# Altium project BugBuster_HAT.PrjPcb
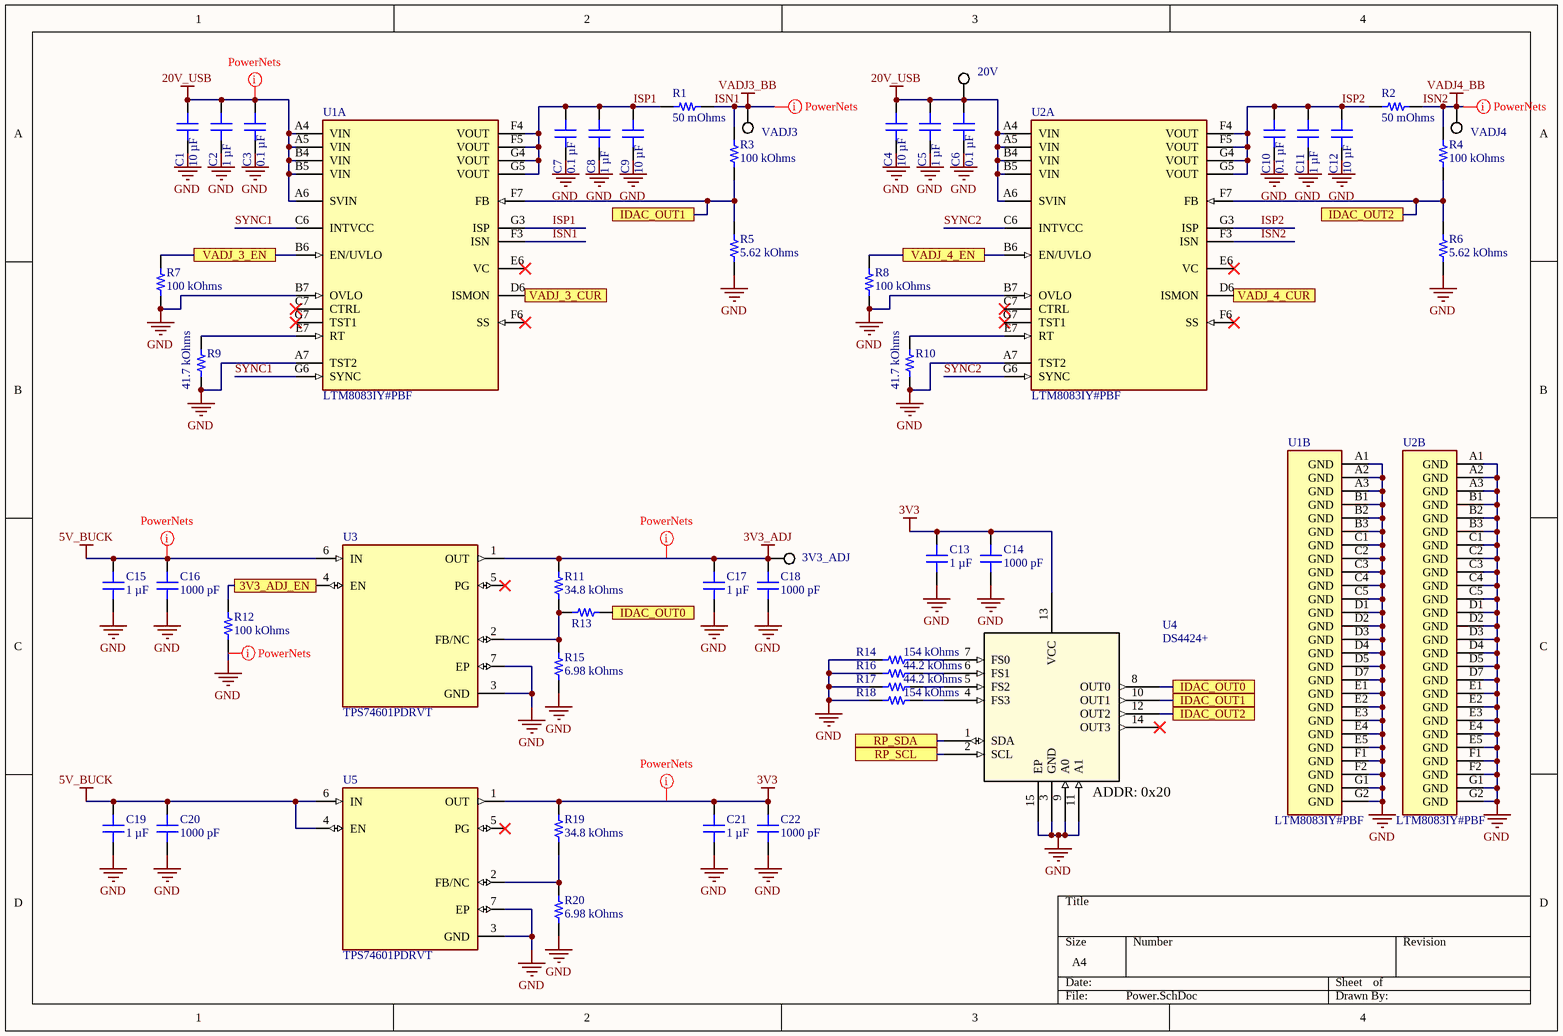
[diagram p0: Power.SchDoc]
3 sheets, 115 parts. Net scope: flat (ports and power ports of the same name join across sheets).
Board file: BugBuster_HAT.PcbDoc
Sheets:
  Power.SchDoc
  RP2040.SchDoc
  IOs.SchDoc

## Sheet Power.SchDoc
size A4; SheetNumber: 1; SheetTotal: 3

### Parts
3V3_ADJ  TP_SMD_1  [TP_1.0mm]  (value not drawn)  (no BOM)
20V  TP_SMD_1  [TP_1.0mm]  (value not drawn)  (no BOM)
C1  10 µF  [CAP 1210_3225 - 1MM]
C2  1 µF  [CAP 0603_1608]
C3  0.1 µF  [CAP 0603_1608]
C4  10 µF  [CAP 1210_3225 - 1MM]
C5  1 µF  [CAP 0603_1608]
C6  0.1 µF  [CAP 0603_1608]
C7  0.1 µF  [CAP 0603_1608]
C8  1 µF  [CAP 0603_1608]
C9  10 µF  [CAP 1210_3225 - 1MM]
C10  0.1 µF  [CAP 0603_1608]
C11  1 µF  [CAP 0603_1608]
C12  10 µF  [CAP 1210_3225 - 1MM]
C13  1 µF  [CAP 0603_1608]
C14  1000 pF  [CAP 0603_1608]
C15  1 µF  [CAP 0603_1608]
C16  1000 pF  [CAP 0603_1608]
C17  1 µF  [CAP 0603_1608]
C18  1000 pF  [CAP 0603_1608]
C19  1 µF  [CAP 0603_1608]
C20  1000 pF  [CAP 0603_1608]
C21  1 µF  [CAP 0603_1608]
C22  1000 pF  [CAP 0603_1608]
R1  50 mOhms  [STACKPOLE CSR1206]
R2  50 mOhms  [STACKPOLE CSR1206]
R3  100 kOhms  [RES 0603_1608]
R4  100 kOhms  [RES 0603_1608]
R5  5.62 kOhms  [RES 0603_1608]
R6  5.62 kOhms  [RES 0603_1608]
R7  100 kOhms  [RES 0603_1608]
R8  100 kOhms  [RES 0603_1608]
R9  41.7 kOhms  [RES 0603_1608]
R10  41.7 kOhms  [RES 0603_1608]
R11  34.8 kOhms  [RES 0603_1608]
R12  100 kOhms  [RES 0603_1608]
R13  (no value)  [RES 0603_1608]
R14  154 kOhms  [RES 0603_1608]
R15  6.98 kOhms  [RES 0603_1608]
R16  44.2 kOhms  [RES 0603_1608]
R17  44.2 kOhms  [RES 0603_1608]
R18  154 kOhms  [RES 0603_1608]
R19  34.8 kOhms  [RES 0603_1608]
R20  6.98 kOhms  [RES 0603_1608]
U1  LTM8083IY#PBF  [FP-BGA-49-05-08-1518-MFG]  (parts A,B of 2)
U2  LTM8083IY#PBF  [FP-BGA-49-05-08-1518-MFG]  (parts A,B of 2)
U3  TPS74601PDRVT  [SON65P200X200X80-7N]
U4  DS4424+  [21-0137_T1433+2_MXM]
U5  TPS74601PDRVT  [SON65P200X200X80-7N]
VADJ3  TP_SMD_1  [TP_1.0mm]  (value not drawn)  (no BOM)
VADJ4  TP_SMD_1  [TP_1.0mm]  (value not drawn)  (no BOM)

### Ports
3V3_ADJ_EN, IDAC_OUT0, IDAC_OUT1, IDAC_OUT2, RP_SCL, RP_SDA, VADJ_3_CUR, VADJ_3_EN, VADJ_4_CUR, VADJ_4_EN

### Nets
3V3: C13.2 C14.2 C21.2 C22.2 R19.2 U4.13(VCC) U5.1(OUT)
3V3_ADJ: 3V3_ADJ.1 C17.2 C18.2 R11.2 U3.1(OUT)
5V_BUCK: C15.2 C16.2 C19.2 C20.2 U3.6(IN) U5.4(EN) U5.6(IN)
20V_USB: 20V.1 C1.2 C2.2 C3.2 C4.2 C5.2 C6.2 U1.A4(VIN) U1.A5(VIN) U1.A6(SVIN) U1.B4(VIN) U1.B5(VIN) U2.A4(VIN) U2.A5(VIN) U2.A6(SVIN) U2.B4(VIN) U2.B5(VIN)
GND: C1.1 C2.1 C3.1 C4.1 C5.1 C6.1 C7.1 C8.1 C9.1 C10.1 C11.1 C12.1 C13.1 C14.1 C15.1 C16.1 C17.1 C18.1 C19.1 C20.1 C21.1 C22.1 R5.1 R6.1 R7.1 R8.1 R9.1 R10.1 R12.1 R14.1 R15.1 R16.2 R17.2 R18.1 R20.1 U1.A1(GND) U1.A2(GND) U1.A3(GND) U1.A7(TST2) U1.B1(GND) U1.B2(GND) U1.B3(GND) U1.B7(OVLO) U1.C1(GND) U1.C2(GND) U1.C3(GND) U1.C4(GND) U1.C5(GND) U1.D1(GND) U1.D2(GND) U1.D3(GND) U1.D4(GND) U1.D5(GND) U1.D7(GND) U1.E1(GND) U1.E2(GND) U1.E3(GND) U1.E4(GND) U1.E5(GND) U1.F1(GND) U1.F2(GND) U1.G1(GND) U1.G2(GND) U2.A1(GND) U2.A2(GND) U2.A3(GND) U2.A7(TST2) U2.B1(GND) U2.B2(GND) U2.B3(GND) U2.B7(OVLO) U2.C1(GND) U2.C2(GND) U2.C3(GND) U2.C4(GND) U2.C5(GND) U2.D1(GND) U2.D2(GND) U2.D3(GND) U2.D4(GND) U2.D5(GND) U2.D7(GND) U2.E1(GND) U2.E2(GND) U2.E3(GND) U2.E4(GND) U2.E5(GND) U2.F1(GND) U2.F2(GND) U2.G1(GND) U2.G2(GND) U3.3(GND) U3.7(EP) U4.3(GND) U4.9(A0) U4.11(A1) U4.15(EP) U5.3(GND) U5.7(EP)
ISN1: R1.2 R3.2 U1.F3(ISN) VADJ3.1  [also labelled VADJ3_BB]
ISN2: R2.2 R4.2 U2.F3(ISN) VADJ4.1  [also labelled VADJ4_BB]
ISP1: C7.2 C8.2 C9.2 R1.1 U1.F4(VOUT) U1.F5(VOUT) U1.G3(ISP) U1.G4(VOUT) U1.G5(VOUT)
ISP2: C10.2 C11.2 C12.2 R2.1 U2.F4(VOUT) U2.F5(VOUT) U2.G3(ISP) U2.G4(VOUT) U2.G5(VOUT)
SCL: U4.2(SCL) ; port RP_SCL
SDA: U4.1(SDA) ; port RP_SDA
SYNC1: U1.C6(INTVCC) U1.G6(SYNC)
SYNC2: U2.C6(INTVCC) U2.G6(SYNC)
NetR3_1: R3.1 R5.2 U1.F7(FB) U4.10(OUT1) ; port IDAC_OUT1
NetR4_1: R4.1 R6.2 U2.F7(FB) U4.12(OUT2) ; port IDAC_OUT2
NetR7_2: R7.2 U1.B6(EN/UVLO) ; port VADJ_3_EN
NetR8_2: R8.2 U2.B6(EN/UVLO) ; port VADJ_4_EN
NetR9_2: R9.2 U1.E7(RT)
NetR10_2: R10.2 U2.E7(RT)
NetR11_1: R11.1 R13.1 R15.2 U3.2(FB/NC)
NetR12_2: R12.2 U3.4(EN) ; port 3V3_ADJ_EN
NetR13_2: R13.2 U4.8(OUT0) ; port IDAC_OUT0
NetR14_2: R14.2 U4.7(FS0)
NetR16_1: R16.1 U4.6(FS1)
NetR17_1: R17.1 U4.5(FS2)
NetR18_2: R18.2 U4.4(FS3)
NetR19_1: R19.1 R20.2 U5.2(FB/NC)
NetU1_D6: U1.D6(ISMON) ; port VADJ_3_CUR
NetU2_D6: U2.D6(ISMON) ; port VADJ_4_CUR

Not connected (* = marked no-connect by the designer): U1 C7(CTRL)* E6(VC)* F6(SS)* G7(TST1)*; U2 C7(CTRL)* E6(VC)* F6(SS)* G7(TST1)*; U3 5(PG)*; U4 14(OUT3)*; U5 5(PG)*

### Layout directives
net class PowerNets: 3V3, 3V3_ADJ, 5V_BUCK, 20V_USB, GND, ISN1, ISN2

### Notes on the sheet
- (near U4) ADDR: 0x20

### Library data of the parts
C1 C4 C9 C12 = GMC32X5R106M50NT: CAP1210 X5R 10UF 20% 50V; manufacturer: Cal-Chip Electronics, Inc.; Part Number: GMC32X5R106M50NT; Value: 10 µF; Applications: General Purpose; Capacitance: 10 µF; componentlink1description: Datasheet; componentlink1url: https://calchip.com/wp-content/uploads/2023/05/gmc_series.pdf; componentlink2description: DigiKey Link; componentlink2url: https://www.digikey.com/en/products/detail/cal-chip-electronics-inc/GMC32X5R106M50NT/21802006; Device Package: 1210 (3225 Metric); lastupdated: 04/06/2024 19:20:41; Lifecycle Status: Active; Minimum Order: 1; Mounting Type: Surface Mount, MLCC; Operating Temperature: -55°C ~ 85°C; Package / Case: 1210 (3225 Metric); packaging: TapeAndReel; partid: 58255; price: 0.13; series: GMC; Size / Dimension: 0.126" L x 0.098" W (3.20mm x 2.50mm); Supplier 1: DigiKey; Supplier Part Number 1: 4713-GMC32X5R106M50NTCT-ND; Temperature Coefficient: X5R; Thickness (Max): 0.110" (2.80mm); Tolerance: ±20%; Voltage - Rated: 50V
C2 C5 C8 C11 C13 C15 C17 C19 C21 = C1608X5R1H105K080AB: CAP CER 1UF 50V X5R 0603; manufacturer: TDK Corporation; Tolerance: ±10%; Part Number: C1608X5R1H105K080AB; Value: 1 µF; Applications: General Purpose; Capacitance: 1 µF; componentlink1description: Datasheet; componentlink1url: https://product.tdk.com/info/en/catalog/datasheets/mlcc_commercial_general_en.pdf?ref_disty=digikey; componentlink2description: DigiKey Link; componentlink2url: https://www.digikey.com/en/products/detail/tdk-corporation/C1608X5R1H105K080AB/2732903; Device Package: 0603 (1608 Metric); Features: Low ESL; lastupdated: 09/02/2024 20:10:02; Lifecycle Status: Active; Minimum Order: 1; Mounting Type: Surface Mount, MLCC; Operating Temperature: -55°C ~ 85°C; Package / Case: 0603 (1608 Metric); packaging: TapeAndReel; partid: 36337; Part Status: Active; price: 0.02; series: C; Size / Dimension: 0.063" L x 0.031" W (1.60mm x 0.80mm); Supplier 1: DigiKey; Supplier Part Number 1: 445-7468-1-ND; Temperature Coefficient: X5R; Thickness (Max): 0.035" (0.90mm); Voltage - Rated: 50V
C3 C6 C7 C10 = CGA3E2X7R1H104M080AE: CAP CER 0.1UF 50V X7R 0603; manufacturer: TDK Corporation; Tolerance: ±20%; Part Number: CGA3E2X7R1H104M080AE; Value: 0.1 µF; Applications: Automotive, Boardflex Sensitive; Capacitance: 0.1 µF; componentlink1description: Datasheet; componentlink1url: https://product.tdk.com/info/en/catalog/datasheets/mlcc_automotive_soft_en.pdf?ref_disty=digikey; componentlink2description: DigiKey Link; componentlink2url: https://www.digikey.com/en/products/detail/tdk-corporation/CGA3E2X7R1H104M080AE/4490595; Device Package: 0603 (1608 Metric); Features: Soft Termination; lastupdated: 09/02/2024 20:10:15; Lifecycle Status: Active; Minimum Order: 1; Mounting Type: Surface Mount, MLCC; Operating Temperature: -55°C ~ 125°C; Package / Case: 0603 (1608 Metric); packaging: TapeAndReel; partid: 13634; Part Status: Active; price: 0.03; Ratings: AEC-Q200; series: CGA; Size / Dimension: 0.063" L x 0.031" W (1.60mm x 0.80mm); Supplier 1: DigiKey; Supplier Part Number 1: 445-15958-1-ND; Temperature Coefficient: X7R; Thickness (Max): 0.037" (0.95mm); Voltage - Rated: 50V
C14 C16 C18 C20 C22 = CC0603GRNPO8BN102: CAP CER 1000PF 25V C0G/NPO 0603; manufacturer: Yageo; Temperature Coefficient: C0G, NP0; Tolerance: ±2%; Part Number: CC0603GRNPO8BN102; Value: 1000 pF; Applications: General Purpose; Capacitance: 1000 pF; componentlink1description: Datasheet; componentlink1url: https://www.yageo.com/upload/media/product/productsearch/datasheet/mlcc/UPY-GP_NP0_16V-to-50V_17.pdf; componentlink2description: DigiKey Link; componentlink2url: https://www.digikey.com/en/products/detail/yageo/CC0603GRNPO8BN102/5883535; Device Package: 0603 (1608 Metric); lastupdated: 09/02/2024 20:10:07; Lifecycle Status: Active; Minimum Order: 1; Mounting Type: Surface Mount, MLCC; Operating Temperature: -55°C ~ 125°C; Package / Case: 0603 (1608 Metric); packaging: TapeAndReel; partid: 17388; Part Status: Active; price: 0.02; series: CC; Size / Dimension: 0.063" L x 0.031" W (1.60mm x 0.80mm); Supplier 1: DigiKey; Supplier Part Number 1: 311-3914-1-ND; Thickness (Max): 0.035" (0.90mm); Voltage - Rated: 25V
R1 R2 = ERJ-8BWJR050V: RES 0.05 OHM 5% 1W 1206; Manufacturer: Panasonic Electronic Components; Temperature Coefficient: 0/ +100ppm/°C; Part Number: ERJ-8BWJR050V; Package / Case: 1206 (3216 Metric); ComponentLink1Description: Datasheet; ComponentLink1URL: https://industrial.panasonic.com/cdbs/www-data/pdf/RDN0000/AOA0000C313.pdf; ComponentLink2Description: DigiKey Link; ComponentLink2URL: https://www.digikey.com/en/products/detail/panasonic-electronic-components/ERJ-8BWJR050V/5647727; Composition: Thick Film; Device Package: 1206 (3216 Metric); Features: Automotive AEC-Q200, Current Sense; Height - Seated (Max): 0.030" (0.75mm); LastUpdated: 03/06/2024 19:49:36; Lifecycle Status: Active; Minimum Order: 1; Number of Terminations: 2; Operating Temperature: -55°C ~ 155°C; Packaging: TapeAndReel; PartId: 2335; Part Status: Active; Power (Watts): 1W; Price: 0.11; Ratings: AEC-Q200; Resistance: 50 mOhms; Series: ERJ-8BW; Size / Dimension: 0.126" L x 0.063" W (3.20mm x 1.60mm); Supplier 1: DigiKey; Supplier Part Number 1: P17694CT-ND; Supplier Device Package: 1206; Tolerance: ±5%; Value: 50 mOhms
R3 R4 R7 R8 R12 = SG73P1JTTD1003F: RES 100K OHM 1% 1/3W 0603; Manufacturer: KOA Speer Electronics, Inc.; Power (Watts): 0.333W, 1/3W; Temperature Coefficient: ±100ppm/°C; Part Number: SG73P1JTTD1003F; Value: 100 kOhms; ComponentLink1Description: Datasheet; ComponentLink1URL: https://www.koaspeer.com/pdfs/SG73P.pdf; ComponentLink2Description: DigiKey Link; ComponentLink2URL: https://www.digikey.com/en/products/detail/koa-speer-electronics-inc/SG73P1JTTD1003F/10188341; Composition: Thick Film; Device Package: 0603 (1608 Metric); Features: Automotive AEC-Q200, Pulse Withstanding; Height - Seated (Max): 0.022" (0.55mm); LastUpdated: 09/02/2024 20:40:28; Lifecycle Status: Active; Minimum Order: 1; Number of Terminations: 2; Operating Temperature: -55°C ~ 155°C; Package / Case: 0603 (1608 Metric); Packaging: TapeAndReel; PartId: 83707; Price: 0.01; Ratings: AEC-Q200; Resistance: 100 kOhms; Series: SG73P; Size / Dimension: 0.063" L x 0.031" W (1.60mm x 0.80mm); Supplier 1: DigiKey; Supplier Part Number 1: 2019-SG73P1JTTD1003FCT-ND; Supplier Device Package: 0603; Tolerance: ±1%
R5 R6 = ERJ-3EKF5621V: RES SMD 5.62K OHM 1% 1/10W 0603; Manufacturer: Panasonic Electronic Components; Power (Watts): 0.1W, 1/10W; Temperature Coefficient: ±100ppm/°C; Part Number: ERJ-3EKF5621V; Value: 5.62 kOhms; ComponentLink1Description: Datasheet; ComponentLink1URL: https://industrial.panasonic.com/cdbs/www-data/pdf/RDA0000/AOA0000C304.pdf; ComponentLink2Description: DigiKey Link; ComponentLink2URL: https://www.digikey.com/en/products/detail/panasonic-electronic-components/ERJ-3EKF5621V/196387; Composition: Thick Film; Device Package: 0603 (1608 Metric); Features: Automotive AEC-Q200; Height - Seated (Max): 0.022" (0.55mm); LastUpdated: 09/02/2024 20:41:56; Lifecycle Status: Active; Minimum Order: 1; Number of Terminations: 2; Operating Temperature: -55°C ~ 155°C; Package / Case: 0603 (1608 Metric); Packaging: TapeAndReel; PartId: 26114; Part Status: Active; Price: 0.01; Ratings: AEC-Q200; Resistance: 5.62 kOhms; Series: ERJ-3EK; Size / Dimension: 0.063" L x 0.031" W (1.60mm x 0.80mm); Supplier 1: DigiKey; Supplier Part Number 1: P5.62KHCT-ND; Supplier Device Package: 0603; Tolerance: ±1%
R9 R10 = RN73R1JTTD4172F10: RES 41.7K OHM 1% 1/10W 0603; Manufacturer: KOA Speer Electronics, Inc.; Power (Watts): 0.1W, 1/10W; Temperature Coefficient: ±10ppm/°C; Part Number: RN73R1JTTD4172F10; Value: 41.7 kOhms; ComponentLink1Description: Datasheet; ComponentLink1URL: https://media.digikey.com/pdf/Data%20Sheets/KOA%20Speer/RN73R_Type_DS.pdf; ComponentLink2Description: DigiKey Link; ComponentLink2URL: https://www.digikey.com/en/products/detail/koa-speer-electronics-inc/RN73R1JTTD4172F10/10017113; Composition: Thin Film; Device Package: 0603 (1608 Metric); Features: Automotive AEC-Q200, Moisture Resistant; Height - Seated (Max): 0.022" (0.55mm); LastUpdated: 09/02/2024 20:41:25; Lifecycle Status: Active; Minimum Order: 1; Number of Terminations: 2; Operating Temperature: -55°C ~ 155°C; Package / Case: 0603 (1608 Metric); Packaging: TapeAndReel; PartId: 62816; Part Status: Active; Price: 0.08; Ratings: AEC-Q200; Resistance: 41.7 kOhms; Series: RN73R; Size / Dimension: 0.063" L x 0.031" W (1.60mm x 0.80mm); Supplier 1: DigiKey; Supplier Part Number 1: 2019-RN73R1JTTD4172F10CT-ND; Supplier Device Package: 0603; Tolerance: ±1%
R11 R19 = CRCW060334K8FKEA: RES SMD 34.8K OHM 1% 1/10W 0603; Manufacturer: Vishay Dale; Power (Watts): 0.1W, 1/10W; Temperature Coefficient: ±100ppm/°C; Part Number: CRCW060334K8FKEA; Value: 34.8 kOhms; ComponentLink1Description: Datasheet; ComponentLink1URL: http://www.vishay.com/docs/20035/dcrcwe3.pdf; ComponentLink2Description: DigiKey Link; ComponentLink2URL: https://www.digikey.com/en/products/detail/vishay-dale/CRCW060334K8FKEA/1174842; Composition: Thick Film; Device Package: 0603 (1608 Metric); Features: Automotive AEC-Q200; Height - Seated (Max): 0.020" (0.50mm); LastUpdated: 09/02/2024 20:43:05; Lifecycle Status: Active; Minimum Order: 1; Number of Terminations: 2; Operating Temperature: -55°C ~ 155°C; Package / Case: 0603 (1608 Metric); Packaging: TapeAndReel; PartId: 12662; Part Status: Active; Price: 0.01; Ratings: AEC-Q200; Resistance: 34.8 kOhms; Series: CRCW; Size / Dimension: 0.061" L x 0.033" W (1.55mm x 0.85mm); Supplier 1: DigiKey; Supplier Part Number 1: 541-34.8KHCT-ND; Supplier Device Package: 0603; Tolerance: ±1%
R13 = MCT0603MZ0000ZP500: RES 0 OHM JUMPER 1/8W 0603; Manufacturer: Vishay Beyschlag; Power (Watts): 0.125W, 1/8W; Part Number: MCT0603MZ0000ZP500; ComponentLink1Description: Datasheet; ComponentLink1URL: http://www.vishay.com/docs/28760/mcat_pro.pdf; ComponentLink2Description: DigiKey Link; ComponentLink2URL: http://digikey.com/product-detail/en/vishay-beyschlag/MCT0603MZ0000ZP500/749-1745-1-ND/7348053; Composition: Thin Film; Device Package: 0603 (1608 Metric); Features: Anti-Sulfur, Automotive AEC-Q200; Height - Seated (Max): 0.022" (0.55mm); LastUpdated: 14/02/2022 15:05:22; Lifecycle Status: Active; Minimum Order: 1; Number of Terminations: 2; Operating Temperature: -55°C ~ 155°C; Package / Case: 0603 (1608 Metric); Packaging: TapeAndReel; PartId: 10258; Part Status: Active; Price: 0.04; Ratings: AEC-Q200; Series: MCT AT - Professional; Size / Dimension: 0.061" L x 0.033" W (1.55mm x 0.85mm); Supplier 1: DigiKey; Supplier Part Number 1: 749-1745-1-ND; Supplier Device Package: 0603; Tolerance: Jumper
R14 R18 = AC0603FR-07154KL: RES SMD 154K OHM 1% 1/10W 0603; Manufacturer: Yageo; Power (Watts): 0.1W, 1/10W; Temperature Coefficient: ±100ppm/°C; Part Number: AC0603FR-07154KL; Value: 154 kOhms; ComponentLink1Description: Datasheet; ComponentLink1URL: https://media.digikey.com/pdf/Data%20Sheets/Yageo%20PDFs/AC%20Series,%20Automotive.pdf; ComponentLink2Description: DigiKey Link; ComponentLink2URL: https://www.digikey.com/en/products/detail/yageo/AC0603FR-07154KL/5895797; Composition: Thick Film; Device Package: 0603 (1608 Metric); Features: Automotive AEC-Q200, Moisture Resistant; Height - Seated (Max): 0.022" (0.55mm); LastUpdated: 09/02/2024 20:40:39; Lifecycle Status: Active; Minimum Order: 1; Number of Terminations: 2; Operating Temperature: -55°C ~ 155°C; Package / Case: 0603 (1608 Metric); Packaging: CutTape; PartId: 79462; Price: 0.01; Ratings: AEC-Q200; Resistance: 154 kOhms; Series: AC; Size / Dimension: 0.063" L x 0.031" W (1.60mm x 0.80mm); Supplier 1: DigiKey; Supplier Part Number 1: 13-AC0603FR-07154KLCT-ND; Supplier Device Package: 0603; Tolerance: ±1%
R15 R20 = CRCW06036K98FKEA: RES SMD 6.98K OHM 1% 1/10W 0603; Manufacturer: Vishay Dale; Power (Watts): 0.1W, 1/10W; Temperature Coefficient: ±100ppm/°C; Part Number: CRCW06036K98FKEA; Value: 6.98 kOhms; ComponentLink1Description: Datasheet; ComponentLink1URL: http://www.vishay.com/docs/20035/dcrcwe3.pdf; ComponentLink2Description: DigiKey Link; ComponentLink2URL: https://www.digikey.com/en/products/detail/vishay-dale/CRCW06036K98FKEA/1174765; Composition: Thick Film; Device Package: 0603 (1608 Metric); Features: Automotive AEC-Q200; Height - Seated (Max): 0.020" (0.50mm); LastUpdated: 09/02/2024 20:43:25; Lifecycle Status: Active; Minimum Order: 1; Number of Terminations: 2; Operating Temperature: -55°C ~ 155°C; Package / Case: 0603 (1608 Metric); Packaging: TapeAndReel; PartId: 7857; Part Status: Active; Price: 0.01; Ratings: AEC-Q200; Resistance: 6.98 kOhms; Series: CRCW; Size / Dimension: 0.061" L x 0.033" W (1.55mm x 0.85mm); Supplier 1: DigiKey; Supplier Part Number 1: 541-6.98KHCT-ND; Supplier Device Package: 0603; Tolerance: ±1%
R16 R17 = RC0603FR-0744K2L: RES 44.2K OHM 1% 1/10W 0603; Manufacturer: Yageo; Power (Watts): 0.1W, 1/10W; Temperature Coefficient: ±100ppm/°C; Part Number: RC0603FR-0744K2L; Value: 44.2 kOhms; ComponentLink1Description: Datasheet; ComponentLink1URL: https://www.yageo.com/upload/media/product/productsearch/datasheet/rchip/PYu-RC_Group_51_RoHS_L_10.pdf; ComponentLink2Description: DigiKey Link; ComponentLink2URL: https://www.digikey.com/en/products/detail/yageo/RC0603FR-0744K2L/727241; Composition: Thick Film; Device Package: 0603 (1608 Metric); Features: Moisture Resistant; Height - Seated (Max): 0.022" (0.55mm); LastUpdated: 09/02/2024 20:43:25; Lifecycle Status: Active; Minimum Order: 1; Number of Terminations: 2; Operating Temperature: -55°C ~ 155°C; Package / Case: 0603 (1608 Metric); Packaging: CutTape; PartId: 7751; Part Status: Active; Price: 0.01; Resistance: 44.2 kOhms; Series: RC_L; Size / Dimension: 0.063" L x 0.031" W (1.60mm x 0.80mm); Supplier 1: DigiKey; Supplier Part Number 1: 311-44.2KHRCT-ND; Supplier Device Package: 0603; Tolerance: ±1%
U1 U2 = CMP-09139-000213-1: 36VIN, 1.5A BUCK-BOOST UMODULE
U3 U5 = TPS74601PDRVT: 1-A, low-IQ, high-accuracy, adjustable ultra-low-dropout voltage regulator with power good & enable; MF: Texas Instruments; SnapEDA_Link: https://www.snapeda.com/parts/TPS74601PDRVT/Texas+Instruments/view-part/?ref=snap; Package: WSON-6 Texas Instruments; Value: *; MP: TPS74601PDRVT; Check_prices: https://www.snapeda.com/parts/TPS74601PDRVT/Texas+Instruments/view-part/?ref=eda
U4 = DS4424: Two-/Four-Channel, IÂ²C, 7-Bit Sink/Source Current DAC; Manufacturer_Name: Analog Devices Inc; Manufacturer_Part_Number: ds4424n+; Copyright: Copyright (C) 2026 Ultra Librarian. All rights reserved.; RefDes: RefDes; Type: Type

## Sheet RP2040.SchDoc
size A4; SheetNumber: 2; SheetTotal: 3
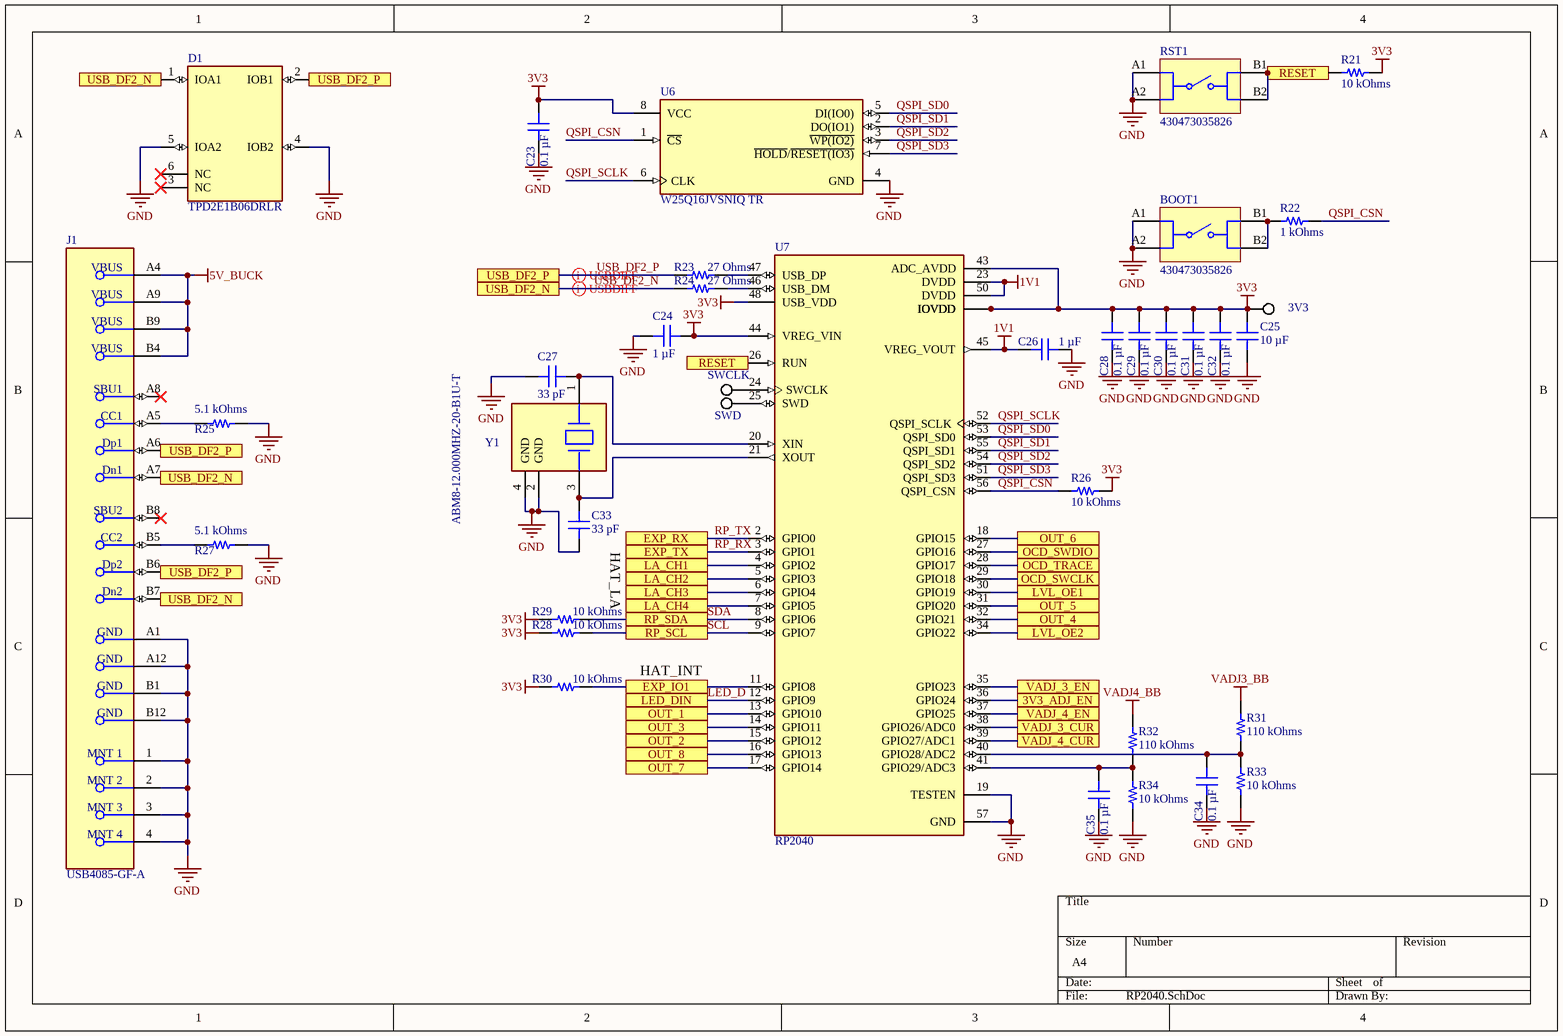
[diagram p1: RP2040.SchDoc]

### Parts
3V3  TP_SMD_1  [TP_1.0mm]  (value not drawn)  (no BOM)
BOOT1  430473035826  [430473035826]
C23  0.1 µF  [CAP 0603_1608]
C24  1 µF  [CAP 0603_1608]
C25  10 µF  [CAP 0603_1608]
C26  1 µF  [CAP 0603_1608]
C27  33 pF  [CAP 0603_1608]
C28  0.1 µF  [CAP 0603_1608]
C29  0.1 µF  [CAP 0603_1608]
C30  0.1 µF  [CAP 0603_1608]
C31  0.1 µF  [CAP 0603_1608]
C32  0.1 µF  [CAP 0603_1608]
C33  33 pF  [CAP 0603_1608]
C34  0.1 µF  [CAP 0603_1608]
C35  0.1 µF  [CAP 0603_1608]
D1  TPD2E1B06DRLR  [FP-DRL0006A-MFG]
J1  USB4085-GF-A  [FP-USB4085-GF-A-MFG]
R21  10 kOhms  [RES 0603_1608]
R22  1 kOhms  [RES 0603_1608]
R23  27 Ohms  [RES 0603_1608]
R24  27 Ohms  [RES 0603_1608]
R25  5.1 kOhms  [RES 0603_1608]
R26  10 kOhms  [RES 0603_1608]
R27  5.1 kOhms  [RES 0603_1608]
R28  10 kOhms  [RES 0603_1608]
R29  10 kOhms  [RES 0603_1608]
R30  10 kOhms  [RES 0603_1608]
R31  110 kOhms  [RES 0603_1608]
R32  110 kOhms  [RES 0603_1608]
R33  10 kOhms  [RES 0603_1608]
R34  10 kOhms  [RES 0603_1608]
RST1  430473035826  [430473035826]
SWCLK  TP_SMD_1  [TP_1.0mm]  (value not drawn)  (no BOM)
SWD  TP_SMD_1  [TP_1.0mm]  (value not drawn)  (no BOM)
U6  W25Q16JVSNIQ TR  [FP-W25Q16JVSNIQ_TR-IPC_A]
U7  RP2040  [QFN40P700X700X90-57N]
Y1  ABM8-12.000MHZ-20-B1U-T  [FP-ABM8-MFG]

### Ports
3V3_ADJ_EN, EXP_IO1, EXP_RX, EXP_TX, LA_CH1, LA_CH2, LA_CH3, LA_CH4, LED_DIN, LVL_OE1, LVL_OE2, OCD_SWCLK, OCD_SWDIO, OCD_TRACE, OUT_1, OUT_2, OUT_3, OUT_4, OUT_5, OUT_6, OUT_7, OUT_8, RESET, RP_SCL, RP_SDA, USB_DF2_N, USB_DF2_P, VADJ_3_CUR, VADJ_3_EN, VADJ_4_CUR, VADJ_4_EN

### Nets
1V1: C26.2 U7.23(DVDD) U7.45(VREG_VOUT) U7.50(DVDD)
3V3: 3V3.1 C23.2 C24.2 C25.2 C28.2 C29.2 C30.2 C31.2 C32.2 R21.1 R26.1 R28.1 R29.1 R30.1 U6.8(VCC) U7.1(IOVDD) U7.10(IOVDD) U7.22(IOVDD) U7.33(IOVDD) U7.42(IOVDD) U7.43(ADC_AVDD) U7.44(VREG_VIN) U7.48(USB_VDD) U7.49(IOVDD)
5V_BUCK: J1.A4(VBUS) J1.A9(VBUS) J1.B4(VBUS) J1.B9(VBUS)
GND: BOOT1.A1 BOOT1.A2 C23.1 C24.1 C25.1 C26.1 C27.1 C28.1 C29.1 C30.1 C31.1 C32.1 C33.1 C34.1 C35.1 D1.4(IOB2) D1.5(IOA2) J1.1(MNT_1) J1.2(MNT_2) J1.3(MNT_3) J1.4(MNT_4) J1.A1(GND) J1.A12(GND) J1.B1(GND) J1.B12(GND) R25.2 R27.2 R33.1 R34.1 RST1.A1 RST1.A2 U6.4(GND) U7.19(TESTEN) U7.57(GND) Y1.2(GND) Y1.4(GND)
VADJ3_BB: R31.2  [project net ISN1]
VADJ4_BB: R32.2  [project net ISN2]
LED_D: U7.12(GPIO9) ; port LED_DIN
QSPI_CSN: R22.2 R26.2 U6.1(~{CS}) U7.56(QSPI_CSN)
QSPI_SCLK: U6.6(CLK) U7.52(QSPI_SCLK)
QSPI_SD0: U6.5(DI(IO0)) U7.53(QSPI_SD0)
QSPI_SD1: U6.2(DO(IO1)) U7.55(QSPI_SD1)
QSPI_SD2: U6.3(~{WP(IO2)}) U7.54(QSPI_SD2)
QSPI_SD3: U6.7(~{HOLD}/~{RESET(IO3)}) U7.51(QSPI_SD3)
RP_RX: U7.3(GPIO1) ; port EXP_TX
RP_TX: U7.2(GPIO0) ; port EXP_RX
SCL: R28.2 U7.9(GPIO7) ; port RP_SCL
SDA: R29.2 U7.8(GPIO6) ; port RP_SDA
USB_DF2_N: D1.1(IOA1) J1.A7(Dn1) J1.B7(Dn2) R24.1 ; port USB_DF2_N
USB_DF2_P: D1.2(IOB1) J1.A6(Dp1) J1.B6(Dp2) R23.1 ; port USB_DF2_P
NetBOOT1_B1: BOOT1.B1 BOOT1.B2 R22.1
NetC27_2: C27.2 U7.20(XIN) Y1.1
NetC33_2: C33.2 U7.21(XOUT) Y1.3
NetC34_2: C34.2 R31.1 R33.2 U7.40(GPIO28/ADC2)
NetC35_2: C35.2 R32.1 R34.2 U7.41(GPIO29/ADC3)
NetJ1_A5: J1.A5(CC1) R25.1
NetJ1_B5: J1.B5(CC2) R27.1
NetJ5_1: R30.2 U7.11(GPIO8) ; port EXP_IO1
NetR7_2: U7.35(GPIO23) ; port VADJ_3_EN
NetR8_2: U7.37(GPIO25) ; port VADJ_4_EN
NetR12_2: U7.36(GPIO24) ; port 3V3_ADJ_EN
NetR21_2: R21.2 RST1.B1 RST1.B2 U7.26(RUN) ; port RESET
NetR23_2: R23.2 U7.47(USB_DP)
NetR24_2: R24.2 U7.46(USB_DM)
NetSWCLK_1: SWCLK.1 U7.24(SWCLK)
NetSWD_1: SWD.1 U7.25(SWD)
NetU1_D6: U7.38(GPIO26/ADC0) ; port VADJ_3_CUR
NetU2_D6: U7.39(GPIO27/ADC1) ; port VADJ_4_CUR
NetU7_4: U7.4(GPIO2) ; port LA_CH1
NetU7_5: U7.5(GPIO3) ; port LA_CH2
NetU7_6: U7.6(GPIO4) ; port LA_CH3
NetU7_7: U7.7(GPIO5) ; port LA_CH4
NetU7_13: U7.13(GPIO10) ; port OUT_1
NetU7_14: U7.14(GPIO11) ; port OUT_3
NetU7_15: U7.15(GPIO12) ; port OUT_2
NetU7_16: U7.16(GPIO13) ; port OUT_8
NetU7_17: U7.17(GPIO14) ; port OUT_7
NetU7_18: U7.18(GPIO15) ; port OUT_6
NetU7_27: U7.27(GPIO16) ; port OCD_SWDIO
NetU7_28: U7.28(GPIO17) ; port OCD_TRACE
NetU7_29: U7.29(GPIO18) ; port OCD_SWCLK
NetU7_30: U7.30(GPIO19) ; port LVL_OE1
NetU7_31: U7.31(GPIO20) ; port OUT_5
NetU7_32: U7.32(GPIO21) ; port OUT_4
NetU7_34: U7.34(GPIO22) ; port LVL_OE2

Not connected (* = marked no-connect by the designer): D1 3(NC)* 6(NC)*; J1 A8(SBU1)* B8(SBU2)*

### Layout directives
differential pair; differential pair class USBDIFF: USB_DF2_N, USB_DF2_P

### Notes on the sheet
- HAT_LA
- HAT_INT

### Library data of the parts
BOOT1 RST1 = CMP-1455-00006-5: Switch Tactile Spst-no 0.05A 12V; Actuator Material: Liquid Crystal Polymer, Polymer; Switch Travel: 250µm; Throw Configuration: SPST; Illumination Type: Non-Illuminated; Insulation Resistance: 100MΩ; Current Rating: 50mA; Switch Function: Off-Mom; Mechanical Life: 500kcycles; Min Operating Temperature: -40°C; Packaging: Tape and Reel; Max Operating Temperature: 85°C; Mount: Surface Mount; Contact Plating: Silver; RoHS: Compliant; Voltage Rating: 12V; Height: 3.5mm
C23 C28-C32 C34 C35 = CGA3E2X7R1H104M080AE: as C3 on sheet Power; Part Number: CGA3E2X7R1H104M080AE; Value: 0.1 µF; Applications: Automotive, Boardflex Sensitive; Capacitance: 0.1 µF; componentlink1description: Datasheet; componentlink1url: https://product.tdk.com/info/en/catalog/datasheets/mlcc_automotive_soft_en.pdf?ref_disty=digikey; componentlink2description: DigiKey Link; componentlink2url: https://www.digikey.com/en/products/detail/tdk-corporation/CGA3E2X7R1H104M080AE/4490595; Device Package: 0603 (1608 Metric); Features: Soft Termination; lastupdated: 09/02/2024 20:10:15; Lifecycle Status: Active; Minimum Order: 1; Mounting Type: Surface Mount, MLCC; Operating Temperature: -55°C ~ 125°C; Package / Case: 0603 (1608 Metric); packaging: TapeAndReel; partid: 13634; Part Status: Active; price: 0.03; Ratings: AEC-Q200; series: CGA; Size / Dimension: 0.063" L x 0.031" W (1.60mm x 0.80mm); Supplier 1: DigiKey; Supplier Part Number 1: 445-15958-1-ND; Temperature Coefficient: X7R; Thickness (Max): 0.037" (0.95mm); Voltage - Rated: 50V
C24 C26 = C1608X5R1H105K080AB: as C2 on sheet Power; Part Number: C1608X5R1H105K080AB; Value: 1 µF; Applications: General Purpose; Capacitance: 1 µF; componentlink1description: Datasheet; componentlink1url: https://product.tdk.com/info/en/catalog/datasheets/mlcc_commercial_general_en.pdf?ref_disty=digikey; componentlink2description: DigiKey Link; componentlink2url: https://www.digikey.com/en/products/detail/tdk-corporation/C1608X5R1H105K080AB/2732903; Device Package: 0603 (1608 Metric); Features: Low ESL; lastupdated: 09/02/2024 20:10:02; Lifecycle Status: Active; Minimum Order: 1; Mounting Type: Surface Mount, MLCC; Operating Temperature: -55°C ~ 85°C; Package / Case: 0603 (1608 Metric); packaging: TapeAndReel; partid: 36337; Part Status: Active; price: 0.02; series: C; Size / Dimension: 0.063" L x 0.031" W (1.60mm x 0.80mm); Supplier 1: DigiKey; Supplier Part Number 1: 445-7468-1-ND; Temperature Coefficient: X5R; Thickness (Max): 0.035" (0.90mm); Voltage - Rated: 50V
C25 = KGM15CS61E106MT: CAP CER 10UF 25V X6S 0603; manufacturer: KYOCERA AVX; Tolerance: ±20%; Part Number: KGM15CS61E106MT; Value: 10 µF; Applications: General Purpose; Capacitance: 10 µF; componentlink1description: Datasheet; componentlink1url: https://datasheets.kyocera-avx.com/x6s-dielectric.pdf; componentlink2description: DigiKey Link; componentlink2url: https://www.digikey.com/en/products/detail/kyocera-avx/KGM15CS61E106MT/16602925; Device Package: 0603 (1608 Metric); lastupdated: 09/02/2024 20:09:18; Lifecycle Status: Active; Minimum Order: 1; Mounting Type: Surface Mount, MLCC; Operating Temperature: -55°C ~ 105°C; Package / Case: 0603 (1608 Metric); packaging: TapeAndReel; partid: 52144; Part Status: Active; price: 0.06; series: KGM - X6S; Size / Dimension: 0.063" L x 0.031" W (1.60mm x 0.80mm); Supplier 1: DigiKey; Supplier Part Number 1: 478-KGM15CS61E106MTCT-ND; Temperature Coefficient: X6S; Thickness (Max): 0.039" (1.00mm); Voltage - Rated: 25V
C27 C33 = CC0603GRNPO9BN330: CAP CER 33PF 50V C0G/NPO 0603; manufacturer: Yageo; Temperature Coefficient: C0G, NP0; Tolerance: ±2%; Part Number: CC0603GRNPO9BN330; Value: 33 pF; Applications: General Purpose; Capacitance: 33 pF; componentlink1description: Datasheet; componentlink1url: https://www.yageo.com/upload/media/product/productsearch/datasheet/mlcc/UPY-GP_NP0_16V-to-50V_17.pdf; componentlink2description: DigiKey Link; componentlink2url: https://www.digikey.com/en/products/detail/yageo/CC0603GRNPO9BN330/5883557; Device Package: 0603 (1608 Metric); lastupdated: 09/02/2024 20:10:23; Lifecycle Status: Active; Minimum Order: 1; Mounting Type: Surface Mount, MLCC; Operating Temperature: -55°C ~ 125°C; Package / Case: 0603 (1608 Metric); packaging: TapeAndReel; partid: 8045; Part Status: Active; price: 0.01; series: CC; Size / Dimension: 0.063" L x 0.031" W (1.60mm x 0.80mm); Supplier 1: DigiKey; Supplier Part Number 1: 311-3931-1-ND; Thickness (Max): 0.035" (0.90mm); Voltage - Rated: 50V
D1 = CMP-04985-000003-1: TVS DIODE 5.5V 15V 6SOT; Manufacturer: Texas Instruments; Peak Pulse Power: 35W; Peak Pulse Current: 2.5A; Direction: Bidirectional; Standoff Height: 0mm; Interface: I2C,USB,LVDS,Other; Number Of Channels: 2; Breakdown Voltage: 7V; Ambient Temperature Range High: +125°C; Package: DRL0006A; Automotive: No; Lead Free: Yes; Temperature Range Low: -40°C; Reverse Standoff Voltage: 5.5V; Clamping Voltage: 15V; Mouser Description: ESD Suppressors / TVS Diodes 2-CH system level ESD protect device; Temperature Range High: +125°C; Device Class L1: Circuit Protection; ComponentLink2Description: Datasheet; RoHS: TRUE; Ambient Temperature Range Low: -40°C; Height: 0.6mm; Device Class L3: unset; Device Class L2: ESD and Circuit Protection ICs; Temperature: -40°C to +125°C; Octopart: https://octopart.com/tpd2e1b06drlr-texas+instruments-30488860; ComponentLink2URL: http://www.ti.com/lit/ds/symlink/tpd2e1b06.pdf; Category: Diode; Manufacturer Part Number: TPD2E1B06DRLR; Digikey Description: TVS DIODE 5.5V 15V 6SOT
J1 = CMP-196119-000001-2: CONN RCPT USB2.0 TYPE C 24POS RA; Gender: Receptacle; Number of Positions: 16; USB Standard: USB 2.0; Orientation: Right Angle; Contact Plating: Gold; Contact Material: Copper Alloy
R21 R26 R28-R30 R33 R34 = SG73S1JTTD1002F: RES 10K OHM 1% 1/5W 0603; Manufacturer: KOA Speer Electronics, Inc.; Power (Watts): 0.2W, 1/5W; Temperature Coefficient: ±100ppm/°C; Part Number: SG73S1JTTD1002F; Value: 10 kOhms; ComponentLink1Description: Datasheet; ComponentLink1URL: http://www.koaspeer.com/catimages/Products/SG73S/SG73S.pdf; ComponentLink2Description: DigiKey Link; ComponentLink2URL: https://www.digikey.com/en/products/detail/koa-speer-electronics-inc/SG73S1JTTD1002F/10279969; Composition: Thick Film; Device Package: 0603 (1608 Metric); Features: Automotive AEC-Q200, Moisture Resistant, Pulse Withstanding; Height - Seated (Max): 0.022" (0.55mm); LastUpdated: 09/02/2024 20:43:35; Lifecycle Status: Active; Minimum Order: 1; Number of Terminations: 2; Operating Temperature: -55°C ~ 155°C; Package / Case: 0603 (1608 Metric); Packaging: TapeAndReel; PartId: 5386; Part Status: Active; Price: 0.01; Ratings: AEC-Q200; Resistance: 10 kOhms; Series: SG73S; Size / Dimension: 0.063" L x 0.031" W (1.60mm x 0.80mm); Supplier 1: DigiKey; Supplier Part Number 1: 2019-SG73S1JTTD1002FCT-ND; Supplier Device Package: 0603; Tolerance: ±1%
R22 = ERJ-PA3J102V: RES SMD 1K OHM 5% 1/3W 0603; Manufacturer: Panasonic Electronic Components; Power (Watts): 0.333W, 1/3W; Temperature Coefficient: ±200ppm/°C; Part Number: ERJ-PA3J102V; Value: 1 kOhms; ComponentLink1Description: Datasheet; ComponentLink1URL: https://industrial.panasonic.com/cdbs/www-data/pdf/RDO0000/AOA0000C331.pdf; ComponentLink2Description: DigiKey Link; ComponentLink2URL: https://www.digikey.com/en/products/detail/panasonic-electronic-components/ERJ-PA3J102V/5035970; Composition: Thick Film; Device Package: 0603 (1608 Metric); Features: Automotive AEC-Q200, Pulse Withstanding; Height - Seated (Max): 0.022" (0.55mm); LastUpdated: 09/02/2024 20:42:47; Lifecycle Status: Active; Minimum Order: 1; Number of Terminations: 2; Operating Temperature: -55°C ~ 155°C; Package / Case: 0603 (1608 Metric); Packaging: TapeAndReel; PartId: 17507; Part Status: Active; Price: 0.01; Ratings: AEC-Q200; Resistance: 1 kOhms; Series: ERJ-PA3; Size / Dimension: 0.063" L x 0.031" W (1.60mm x 0.80mm); Supplier 1: DigiKey; Supplier Part Number 1: P1KBZCT-ND; Supplier Device Package: 0603; Tolerance: ±5%
R23 R24 = CRCW060327R0FKEA: RES SMD 27 OHM 1% 1/10W 0603; Manufacturer: Vishay Dale; Power (Watts): 0.1W, 1/10W; Temperature Coefficient: ±100ppm/°C; Part Number: CRCW060327R0FKEA; Value: 27 Ohms; ComponentLink1Description: Datasheet; ComponentLink1URL: http://www.vishay.com/docs/20035/dcrcwe3.pdf; ComponentLink2Description: DigiKey Link; ComponentLink2URL: https://www.digikey.com/en/products/detail/vishay-dale/CRCW060327R0FKEA/1174487; Composition: Thick Film; Device Package: 0603 (1608 Metric); Features: Automotive AEC-Q200; Height - Seated (Max): 0.020" (0.50mm); LastUpdated: 09/02/2024 20:43:24; Lifecycle Status: Active; Minimum Order: 1; Number of Terminations: 2; Operating Temperature: -55°C ~ 155°C; Package / Case: 0603 (1608 Metric); Packaging: TapeAndReel; PartId: 8035; Part Status: Active; Price: 0.01; Ratings: AEC-Q200; Resistance: 27 Ohms; Series: CRCW; Size / Dimension: 0.061" L x 0.033" W (1.55mm x 0.85mm); Supplier 1: DigiKey; Supplier Part Number 1: 541-27.0HCT-ND; Supplier Device Package: 0603; Tolerance: ±1%
R25 R27 = RMCF0603FT5K10: RES 5.1K OHM 1% 1/10W 0603; Manufacturer: Stackpole Electronics Inc; Power (Watts): 0.1W, 1/10W; Temperature Coefficient: ±100ppm/°C; Part Number: RMCF0603FT5K10; Value: 5.1 kOhms; ComponentLink1Description: Datasheet; ComponentLink1URL: https://www.seielect.com/catalog/sei-rmcf_rmcp.pdf; ComponentLink2Description: DigiKey Link; ComponentLink2URL: https://www.digikey.com/en/products/detail/stackpole-electronics-inc/RMCF0603FT5K10/1760908; Composition: Thick Film; Device Package: 0603 (1608 Metric); Features: Automotive AEC-Q200; Height - Seated (Max): 0.022" (0.55mm); LastUpdated: 09/02/2024 20:43:14; Lifecycle Status: Active; Minimum Order: 1; Number of Terminations: 2; Operating Temperature: -55°C ~ 155°C; Package / Case: 0603 (1608 Metric); Packaging: CutTape; PartId: 10617; Part Status: Active; Price: 0.01; Ratings: AEC-Q200; Resistance: 5.1 kOhms; Series: RMCF; Size / Dimension: 0.061" L x 0.031" W (1.55mm x 0.80mm); Supplier 1: DigiKey; Supplier Part Number 1: RMCF0603FT5K10CT-ND; Supplier Device Package: 0603; Tolerance: ±1%
R31 R32 = CRCW0603110KFKEA: RES SMD 110K OHM 1% 1/10W 0603; Manufacturer: Vishay Dale; Power (Watts): 0.1W, 1/10W; Temperature Coefficient: ±100ppm/°C; Part Number: CRCW0603110KFKEA; Value: 110 kOhms; ComponentLink1Description: Datasheet; ComponentLink1URL: http://www.vishay.com/docs/20035/dcrcwe3.pdf; ComponentLink2Description: DigiKey Link; ComponentLink2URL: https://www.digikey.com/en/products/detail/vishay-dale/CRCW0603110KFKEA/1174900; Composition: Thick Film; Device Package: 0603 (1608 Metric); Features: Automotive AEC-Q200; Height - Seated (Max): 0.020" (0.50mm); LastUpdated: 09/02/2024 20:43:25; Lifecycle Status: Active; Minimum Order: 1; Number of Terminations: 2; Operating Temperature: -55°C ~ 155°C; Package / Case: 0603 (1608 Metric); Packaging: TapeAndReel; PartId: 7799; Part Status: Active; Price: 0.01; Ratings: AEC-Q200; Resistance: 110 kOhms; Series: CRCW; Size / Dimension: 0.061" L x 0.033" W (1.55mm x 0.85mm); Supplier 1: DigiKey; Supplier Part Number 1: 541-110KHCT-ND; Supplier Device Package: 0603; Tolerance: ±1%
U6 = CMP-78876-000009-2: IC FLASH 16MBIT SPI/QUAD 8SOIC; NexarPartId: 75645707; Max Supply Voltage: 3.6V; Memory Size: 2MB; Interface: SPI; Access Time: 5ms; Min Supply Voltage: 2.7V; RoHS: Non-Compliant; Min Operating Temperature: -40°C; Memory Type: FLASH; Height: 1.75mm; Schedule B: 8542320070, 8542320070; Ambient Temperature Range High: 85°C; Max Operating Temperature: 85°C
U7 = RP2040: RP2040 chip for Raspberry Pi Pico - ARM® Cortex®-M0+ MCU 32-Bit; SnapEDA_Link: https://www.snapeda.com/parts/RP2040/Raspberry+Pi/view-part/?ref=snap; Package: None; Value: *; MF: Raspberry Pi; MP: RP2040; Check_prices: https://www.snapeda.com/parts/RP2040/Raspberry+Pi/view-part/?ref=eda
Y1 = CMP-27762-006596-1: Crystal 12MHz ±10ppm 20pF SMD-4 3.2mm x 2.5mm

## Sheet IOs.SchDoc
size A4; SheetNumber: 3; SheetTotal: 3
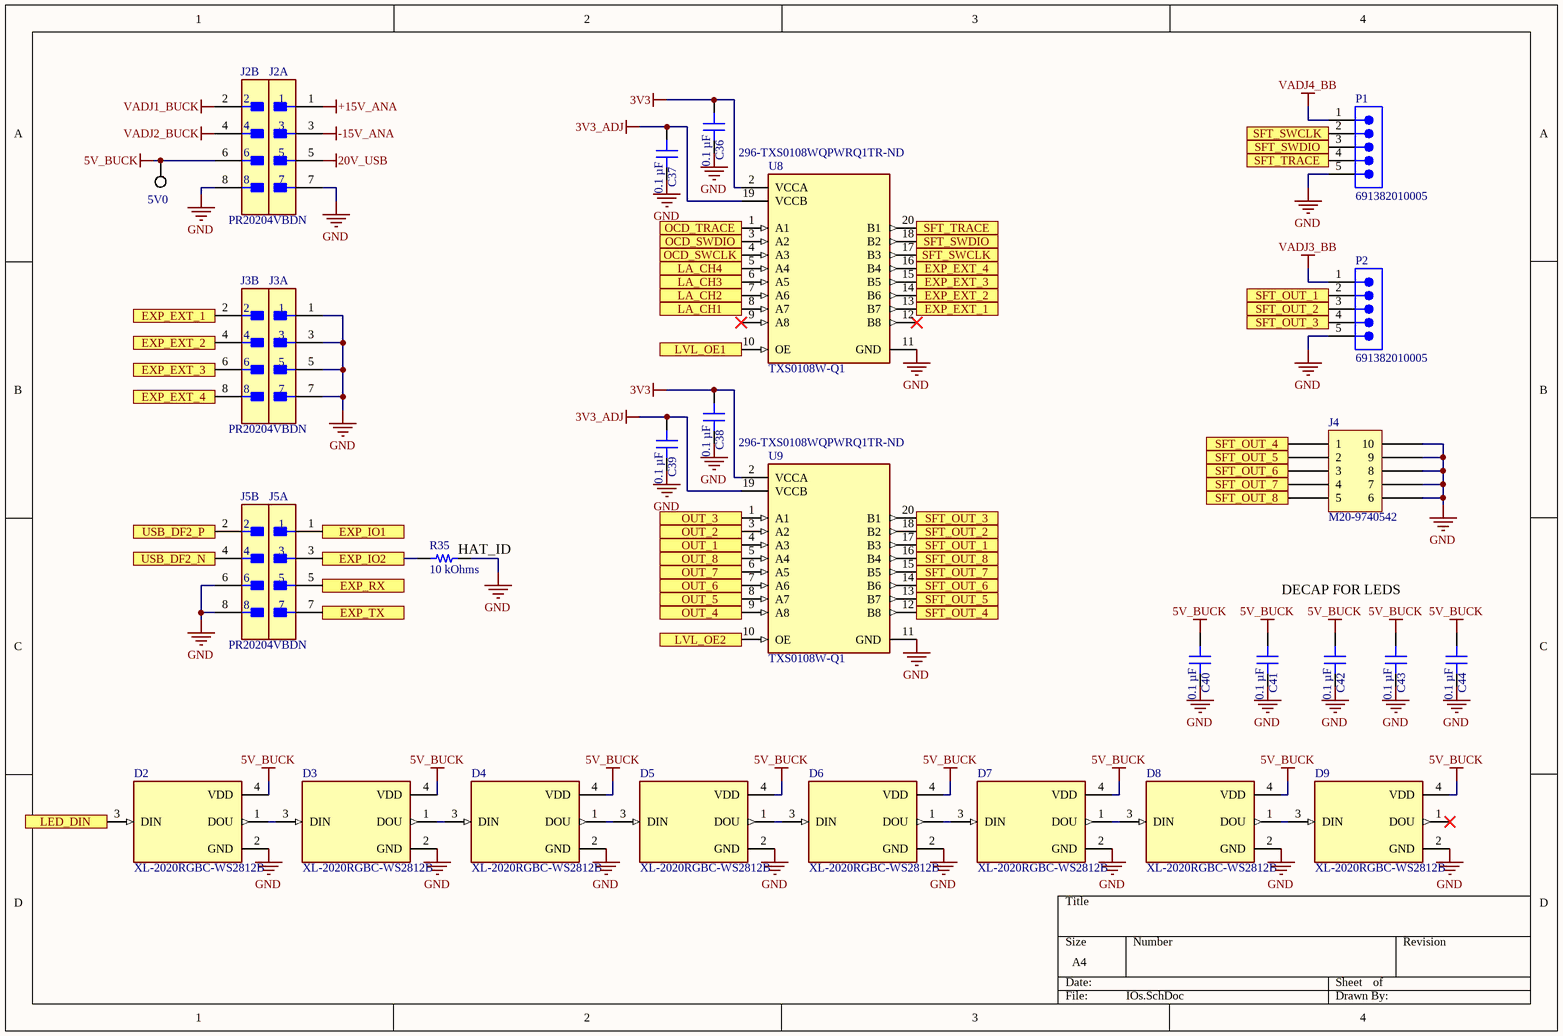
[diagram p2: IOs.SchDoc]

### Parts
5V0  TP_SMD_1  [TP_1.0mm]  (value not drawn)  (no BOM)
C36  0.1 µF  [CAP 0603_1608]
C37  0.1 µF  [CAP 0603_1608]
C38  0.1 µF  [CAP 0603_1608]
C39  0.1 µF  [CAP 0603_1608]
C40  0.1 µF  [CAP 0603_1608]
C41  0.1 µF  [CAP 0603_1608]
C42  0.1 µF  [CAP 0603_1608]
C43  0.1 µF  [CAP 0603_1608]
C44  0.1 µF  [CAP 0603_1608]
D2  XL-2020RGBC-WS2812B  [LED_XL-2020RGBC-WS2812B]
D3  XL-2020RGBC-WS2812B  [LED_XL-2020RGBC-WS2812B]
D4  XL-2020RGBC-WS2812B  [LED_XL-2020RGBC-WS2812B]
D5  XL-2020RGBC-WS2812B  [LED_XL-2020RGBC-WS2812B]
D6  XL-2020RGBC-WS2812B  [LED_XL-2020RGBC-WS2812B]
D7  XL-2020RGBC-WS2812B  [LED_XL-2020RGBC-WS2812B]
D8  XL-2020RGBC-WS2812B  [LED_XL-2020RGBC-WS2812B]
D9  XL-2020RGBC-WS2812B  [LED_XL-2020RGBC-WS2812B]
J2  PR20204VBDN  [FP-PR20204VBDN-MFG]  (parts A,B of 2)
J3  PR20204VBDN  [FP-PR20204VBDN-MFG]  (parts A,B of 2)
J4  M20-9740542  [HARWIN M20-9740545]
J5  PR20204VBDN  [FP-PR20204VBDN-MFG]  (parts A,B of 2)
P1  691382010005  [691382010005]
P2  691382010005  [691382010005]
R35  10 kOhms  [RES 0603_1608]
U8  TXS0108W-Q1  Supplier Part Number 1: 296-TXS0108WQPWRQ1TR-ND  [FP-PW0020A-IPC_C]
U9  TXS0108W-Q1  Supplier Part Number 1: 296-TXS0108WQPWRQ1TR-ND  [FP-PW0020A-IPC_C]

### Ports
EXP_EXT_1, EXP_EXT_2, EXP_EXT_3, EXP_EXT_4, EXP_IO1, EXP_IO2, EXP_RX, EXP_TX, LA_CH1, LA_CH2, LA_CH3, LA_CH4, LED_DIN, LVL_OE1, LVL_OE2, OCD_SWCLK, OCD_SWDIO, OCD_TRACE, OUT_1, OUT_2, OUT_3, OUT_4, OUT_5, OUT_6, OUT_7, OUT_8, SFT_OUT_1, SFT_OUT_2, SFT_OUT_3, SFT_OUT_4, SFT_OUT_5, SFT_OUT_6, SFT_OUT_7, SFT_OUT_8, SFT_SWCLK, SFT_SWDIO, SFT_TRACE, USB_DF2_N, USB_DF2_P

### Nets
3V3: C36.2 C38.2 U8.2(VCCA) U9.2(VCCA)
3V3_ADJ: C37.2 C39.2 U8.19(VCCB) U9.19(VCCB)
5V_BUCK: 5V0.1 C40.2 C41.2 C42.2 C43.2 C44.2 D2.4(VDD) D3.4(VDD) D4.4(VDD) D5.4(VDD) D6.4(VDD) D7.4(VDD) D8.4(VDD) D9.4(VDD) J2.6
20V_USB: J2.5
+15V_ANA: J2.1
-15V_ANA: J2.3
GND: C36.1 C37.1 C38.1 C39.1 C40.1 C41.1 C42.1 C43.1 C44.1 D2.2(GND) D3.2(GND) D4.2(GND) D5.2(GND) D6.2(GND) D7.2(GND) D8.2(GND) D9.2(GND) J2.7 J2.8 J3.1 J3.3 J3.5 J3.7 J4.6 J4.7 J4.8 J4.9 J4.10 J5.6 J5.8 P1.5 P2.5 R35.1 U8.11(GND) U9.11(GND)
VADJ1_BUCK: J2.2
VADJ2_BUCK: J2.4
VADJ3_BB: P2.1  [project net ISN1]
VADJ4_BB: P1.1  [project net ISN2]
LED_D: D2.3(DIN) ; port LED_DIN
RP_RX: J5.7 ; port EXP_TX
RP_TX: J5.5 ; port EXP_RX
USB_DF2_N: J5.4 ; port USB_DF2_N
USB_DF2_P: J5.2 ; port USB_DF2_P
NetD2_1: D2.1(DOU) D3.3(DIN)
NetD3_1: D3.1(DOU) D4.3(DIN)
NetD4_1: D4.1(DOU) D5.3(DIN)
NetD5_1: D5.1(DOU) D6.3(DIN)
NetD6_1: D6.1(DOU) D7.3(DIN)
NetD7_1: D7.1(DOU) D8.3(DIN)
NetD8_1: D8.1(DOU) D9.3(DIN)
NetJ3_2: J3.2 U8.13(B7) ; port EXP_EXT_1
NetJ3_4: J3.4 U8.14(B6) ; port EXP_EXT_2
NetJ3_6: J3.6 U8.15(B5) ; port EXP_EXT_3
NetJ3_8: J3.8 U8.16(B4) ; port EXP_EXT_4
NetJ4_1: J4.1 U9.12(B8) ; port SFT_OUT_4
NetJ4_2: J4.2 U9.13(B7) ; port SFT_OUT_5
NetJ4_3: J4.3 U9.14(B6) ; port SFT_OUT_6
NetJ4_4: J4.4 U9.15(B5) ; port SFT_OUT_7
NetJ4_5: J4.5 U9.16(B4) ; port SFT_OUT_8
NetJ5_1: J5.1 ; port EXP_IO1
NetJ5_3: J5.3 R35.2 ; port EXP_IO2
NetP1_2: P1.2 U8.17(B3) ; port SFT_SWCLK
NetP1_3: P1.3 U8.18(B2) ; port SFT_SWDIO
NetP1_4: P1.4 U8.20(B1) ; port SFT_TRACE
NetP2_2: P2.2 U9.17(B3) ; port SFT_OUT_1
NetP2_3: P2.3 U9.18(B2) ; port SFT_OUT_2
NetP2_4: P2.4 U9.20(B1) ; port SFT_OUT_3
NetU7_4: U8.8(A7) ; port LA_CH1
NetU7_5: U8.7(A6) ; port LA_CH2
NetU7_6: U8.6(A5) ; port LA_CH3
NetU7_7: U8.5(A4) ; port LA_CH4
NetU7_13: U9.4(A3) ; port OUT_1
NetU7_14: U9.1(A1) ; port OUT_3
NetU7_15: U9.3(A2) ; port OUT_2
NetU7_16: U9.5(A4) ; port OUT_8
NetU7_17: U9.6(A5) ; port OUT_7
NetU7_18: U9.7(A6) ; port OUT_6
NetU7_27: U8.3(A2) ; port OCD_SWDIO
NetU7_28: U8.1(A1) ; port OCD_TRACE
NetU7_29: U8.4(A3) ; port OCD_SWCLK
NetU7_30: U8.10(OE) ; port LVL_OE1
NetU7_31: U9.8(A7) ; port OUT_5
NetU7_32: U9.9(A8) ; port OUT_4
NetU7_34: U9.10(OE) ; port LVL_OE2

Not connected (* = marked no-connect by the designer): D9 1(DOU)*; U8 9(A8)* 12(B8)*

### Notes on the sheet
- (near R35) HAT_ID
- DECAP FOR LEDS

### Library data of the parts
C36-C44 = CGA3E2X7R1H104M080AE: as C3 on sheet Power; Part Number: CGA3E2X7R1H104M080AE; Value: 0.1 µF; Applications: Automotive, Boardflex Sensitive; Capacitance: 0.1 µF; componentlink1description: Datasheet; componentlink1url: https://product.tdk.com/info/en/catalog/datasheets/mlcc_automotive_soft_en.pdf?ref_disty=digikey; componentlink2description: DigiKey Link; componentlink2url: https://www.digikey.com/en/products/detail/tdk-corporation/CGA3E2X7R1H104M080AE/4490595; Device Package: 0603 (1608 Metric); Features: Soft Termination; lastupdated: 09/02/2024 20:10:15; Lifecycle Status: Active; Minimum Order: 1; Mounting Type: Surface Mount, MLCC; Operating Temperature: -55°C ~ 125°C; Package / Case: 0603 (1608 Metric); packaging: TapeAndReel; partid: 13634; Part Status: Active; price: 0.03; Ratings: AEC-Q200; series: CGA; Size / Dimension: 0.063" L x 0.031" W (1.60mm x 0.80mm); Supplier 1: DigiKey; Supplier Part Number 1: 445-15958-1-ND; Temperature Coefficient: X7R; Thickness (Max): 0.037" (0.95mm); Voltage - Rated: 50V
D2-D9 = XL-2020RGBC-WS2812B: 2020 RGB LED(BUILT-IN IC); MF: XINGLIGHT; SnapEDA_Link: https://www.snapeda.com/parts/XL-2020RGBC-WS2812B/Xinglight/view-part/?ref=snap; Package: None; Value: *; MP: XL-2020RGBC-WS2812B; Check_prices: https://www.snapeda.com/parts/XL-2020RGBC-WS2812B/Xinglight/view-part/?ref=eda
J2 J3 J5 = CMP-77940-000004-1: PIN HEADER, THR, DUAL ROW, .100"
J4 = M20-9740542: CONN HEADER R/A 10POS 2.54MM; Manufacturer: Harwin Inc.; Connector Type: Header, Cuttable; Contact Length - Mating: 0.228" (5.80mm); Contact Length - Post: 0.118" (3.00mm); Current Rating (Amps): 3A per Contact; Material Flammability Rating: UL94 V-0; Number of Positions: 10; Number of Positions Loaded: All; Pitch - Mating: 0.100" (2.54mm); Shrouding: Unshrouded; Style: Board to Board or Cable; Part Number: M20-9740542; ComponentLink1Description: Datasheet; ComponentLink1URL: https://cdn.harwin.com/pdfs/Harwin_PC_Connectors_M20.pdf; ComponentLink2Description: DigiKey Link; ComponentLink2URL: https://www.digikey.com/en/products/detail/harwin-inc/M20-9740542/3920716; Contact Finish - Mating: Gold; Contact Finish - Post: Tin; Contact Material: Brass; Contact Shape: Square; Contact Type: Male Pin; Fastening Type: Push-Pull; Insulation Color: Black; Insulation Height: 0.200" (5.08mm); Insulation Material: Polyamide (PA6T), Nylon 6T; LastUpdated: 21/09/2022 19:18:08; Lifecycle Status: Active; Minimum Order: 1; Mounting Type: Through Hole, Right Angle; Number of Rows: 2; Operating Temperature: -40°C ~ 105°C; Packaging: Bulk; PartId: 158; Part Status: Active; Price: 0.24; Row Spacing - Mating: 0.100" (2.54mm); Series: M20; Supplier 1: DigiKey; Supplier Part Number 1: 952-3274-ND; Termination: Solder
P1 P2 = CMP-1502-01746-3: Terminal Block, R/A Header, 5Pos, Th Rohs Compliant: Yes; Number of Positions Per Level: 5; Gender: Male; Pitch: 2.4892mm; Current: 12A; Voltage: 300V; Number of Levels: 1; Lead Pitch: 2.5mm; Packaging: Box; Termination: Solder; Min Operating Temperature: -40°C; Number of Pins: 5; Color: Green; RoHS: Compliant; Number of Positions: 5; Max Operating Temperature: 105°C; Mount: Through Hole; Contact Plating: Tin
R35 = SG73S1JTTD1002F: as R21 on sheet RP2040; Part Number: SG73S1JTTD1002F; Value: 10 kOhms; ComponentLink1Description: Datasheet; ComponentLink1URL: http://www.koaspeer.com/catimages/Products/SG73S/SG73S.pdf; ComponentLink2Description: DigiKey Link; ComponentLink2URL: https://www.digikey.com/en/products/detail/koa-speer-electronics-inc/SG73S1JTTD1002F/10279969; Composition: Thick Film; Device Package: 0603 (1608 Metric); Features: Automotive AEC-Q200, Moisture Resistant, Pulse Withstanding; Height - Seated (Max): 0.022" (0.55mm); LastUpdated: 09/02/2024 20:43:35; Lifecycle Status: Active; Minimum Order: 1; Number of Terminations: 2; Operating Temperature: -55°C ~ 155°C; Package / Case: 0603 (1608 Metric); Packaging: TapeAndReel; PartId: 5386; Part Status: Active; Price: 0.01; Ratings: AEC-Q200; Resistance: 10 kOhms; Series: SG73S; Size / Dimension: 0.063" L x 0.031" W (1.60mm x 0.80mm); Supplier 1: DigiKey; Supplier Part Number 1: 2019-SG73S1JTTD1002FCT-ND; Supplier Device Package: 0603; Tolerance: ±1%
U8 U9 = CMP-2000-04956-2: IC TRNSLTR BIDIRECTIONAL 20TSSOP; Number of Inputs: 8; Supply Current: 8uA; Low Level Output Current: 50mA; Min Supply Voltage: 1.2V; Quiescent Current: 3uA; Output Type: Voltage; Propagation Delay: 4.8ns; Max Supply Voltage: 5.5V; Output Current: 620uA; Turn-On Delay Time: 312ns; Logic Function: Translator; Data Rate: 60Mbps; Rise Time: 6.3ns; High Level Output Current: -50mA; Number of Pins: 20; Packaging: Tape and Reel; Max Operating Temperature: 85°C; Height: 1.15mm; Nominal Supply Current: 8uA; Termination: SMD/SMT; Lead Free: Lead Free; Package Quantity: 1; Number of Bits: 8; Weight: 0.002716oz; Contact Plating: Gold; Series: -; Width: 4.4mm; Radiation Hardening: No; Mount: Surface Mount; Length: 6.5mm; Case/Package: TSSOP; REACH SVHC: No SVHC; RoHS Compliant: Yes; Min Operating Temperature: -40°C; Number of Channels: 8; Supplier 1: DigiKey

## Nets that join several sheets
3V3: Power (7 pins), RP2040 (24 pins), IOs (C36.2 C38.2 U8.2 U9.2)
3V3_ADJ: Power (5 pins), IOs (C37.2 C39.2 U8.19 U9.19)
5V_BUCK: Power (7 pins), RP2040 (J1.A4 J1.A9 J1.B4 J1.B9), IOs (15 pins)
20V_USB: Power (17 pins), IOs (J2.5)
GND: Power (99 pins), RP2040 (36 pins), IOs (35 pins)
ISN1: Power (R1.2 R3.2 U1.F3 VADJ3.1), RP2040 (R31.2), IOs (P2.1)
ISN2: Power (R2.2 R4.2 U2.F3 VADJ4.1), RP2040 (R32.2), IOs (P1.1)
LED_D: RP2040 (U7.12), IOs (D2.3)
NetJ5_1: RP2040 (R30.2 U7.11), IOs (J5.1)
NetR7_2: Power (R7.2 U1.B6), RP2040 (U7.35)
NetR8_2: Power (R8.2 U2.B6), RP2040 (U7.37)
NetR12_2: Power (R12.2 U3.4), RP2040 (U7.36)
NetU1_D6: Power (U1.D6), RP2040 (U7.38)
NetU2_D6: Power (U2.D6), RP2040 (U7.39)
NetU7_4: RP2040 (U7.4), IOs (U8.8)
NetU7_5: RP2040 (U7.5), IOs (U8.7)
NetU7_6: RP2040 (U7.6), IOs (U8.6)
NetU7_7: RP2040 (U7.7), IOs (U8.5)
NetU7_13: RP2040 (U7.13), IOs (U9.4)
NetU7_14: RP2040 (U7.14), IOs (U9.1)
NetU7_15: RP2040 (U7.15), IOs (U9.3)
NetU7_16: RP2040 (U7.16), IOs (U9.5)
NetU7_17: RP2040 (U7.17), IOs (U9.6)
NetU7_18: RP2040 (U7.18), IOs (U9.7)
NetU7_27: RP2040 (U7.27), IOs (U8.3)
NetU7_28: RP2040 (U7.28), IOs (U8.1)
NetU7_29: RP2040 (U7.29), IOs (U8.4)
NetU7_30: RP2040 (U7.30), IOs (U8.10)
NetU7_31: RP2040 (U7.31), IOs (U9.8)
NetU7_32: RP2040 (U7.32), IOs (U9.9)
NetU7_34: RP2040 (U7.34), IOs (U9.10)
RP_RX: RP2040 (U7.3), IOs (J5.7)
RP_TX: RP2040 (U7.2), IOs (J5.5)
SCL: Power (U4.2), RP2040 (R28.2 U7.9)
SDA: Power (U4.1), RP2040 (R29.2 U7.8)
USB_DF2_N: RP2040 (D1.1 J1.A7 J1.B7 R24.1), IOs (J5.4)
USB_DF2_P: RP2040 (D1.2 J1.A6 J1.B6 R23.1), IOs (J5.2)